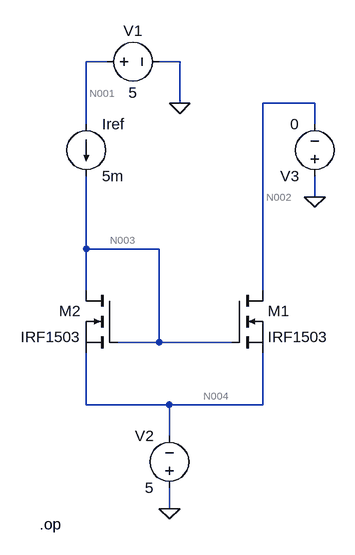
[diagram p0: schematic Experiment 9 - Two transistor current source with FET.asc]
Experiment 9 - Two transistor current source with FET.asc, the LTspice schematic file:
Version 4
SHEET 1 880 680
WIRE 128 -192 96 -192
WIRE 240 -192 208 -192
WIRE 240 -128 240 -192
WIRE 448 -128 368 -128
WIRE 96 -96 96 -192
WIRE 448 -96 448 -128
WIRE 448 16 448 -16
WIRE 96 96 96 -16
WIRE 208 96 96 96
WIRE 96 160 96 96
WIRE 368 160 368 -128
WIRE 208 240 208 96
WIRE 208 240 144 240
WIRE 320 240 208 240
WIRE 96 336 96 256
WIRE 224 336 96 336
WIRE 368 336 368 256
WIRE 368 336 224 336
WIRE 224 384 224 336
WIRE 224 496 224 464
FLAG 448 16 0
FLAG 240 -128 0
FLAG 224 496 0
SYMBOL voltage 448 0 R180
WINDOW 123 0 0 Left 0
WINDOW 39 0 0 Left 0
SYMATTR InstName V3
SYMATTR Value 0
SYMBOL current 96 -96 R0
WINDOW 123 0 0 Left 0
WINDOW 39 0 0 Left 0
SYMATTR InstName Iref
SYMATTR Value 5m
SYMBOL voltage 112 -192 R270
WINDOW 0 32 56 VTop 2
WINDOW 3 -32 56 VBottom 2
WINDOW 123 0 0 Left 0
WINDOW 39 0 0 Left 0
SYMATTR InstName V1
SYMATTR Value 5
SYMBOL voltage 224 480 R180
WINDOW 0 24 96 Left 2
WINDOW 3 24 16 Left 2
WINDOW 123 0 0 Left 0
WINDOW 39 0 0 Left 0
SYMATTR InstName V2
SYMATTR Value 5
SYMBOL nmos 320 160 R0
SYMATTR InstName M1
SYMATTR Value IRF1503
SYMBOL nmos 144 160 M0
SYMATTR InstName M2
SYMATTR Value IRF1503
TEXT 24 520 Left 2 !.op

The netlist it stands for:
* Experiment 9 - Two transistor current source with FET.asc
V3 0 N002 0
Iref N001 N003 5m
V1 N001 0 5
V2 0 N004 5
M1 N002 N003 N004 N004 IRF1503
M2 N003 N003 N004 N004 IRF1503
.model NMOS NMOS
.model PMOS PMOS
.lib standard.mos
.op
.backanno
.end

* Results of the author's LTspice run, read from the files saved beside the schematic
* Operating Point:
*   V(n002) = 0 V
*   V(n001) = 5 V
*   V(n003) = -1.218 V
*   V(n004) = -5 V
*   Id(M2) = 5 mA
*   Ig(M2) = -3.499 nA
*   Is(M2) = -5 mA
*   Id(M1) = 5 mA
*   Ig(M1) = -1.644 nA
*   Is(M1) = -5 mA
*   I(Iref) = 5 mA
*   I(V2) = -10 mA
*   I(V1) = -5 mA
*   I(V3) = 5 mA
* From the log:
*   Semiconductor Device Operating Points:
*                           --- VDMOSFET Transistors ---
*   Name:          m2          m1
*   Model:       irf1503     irf1503
*   Id:          5.00e-03    5.00e-03
*   Vgs:         3.78e+00    3.78e+00
*   Vds:         3.78e+00    5.00e+00
*   Vth:         4.00e+00    4.00e+00
*   Gm:          9.49e-02    9.49e-02
*   Gds:         0.00e+00    0.00e+00
*   Cgs:         7.00e-09    7.00e-09
*   Cgd:         3.50e-09    1.64e-09
*   Cbody:       2.42e-09    2.16e-09